# EAGLE design OpAmpAmplifier (EAGLE 6.5.0)
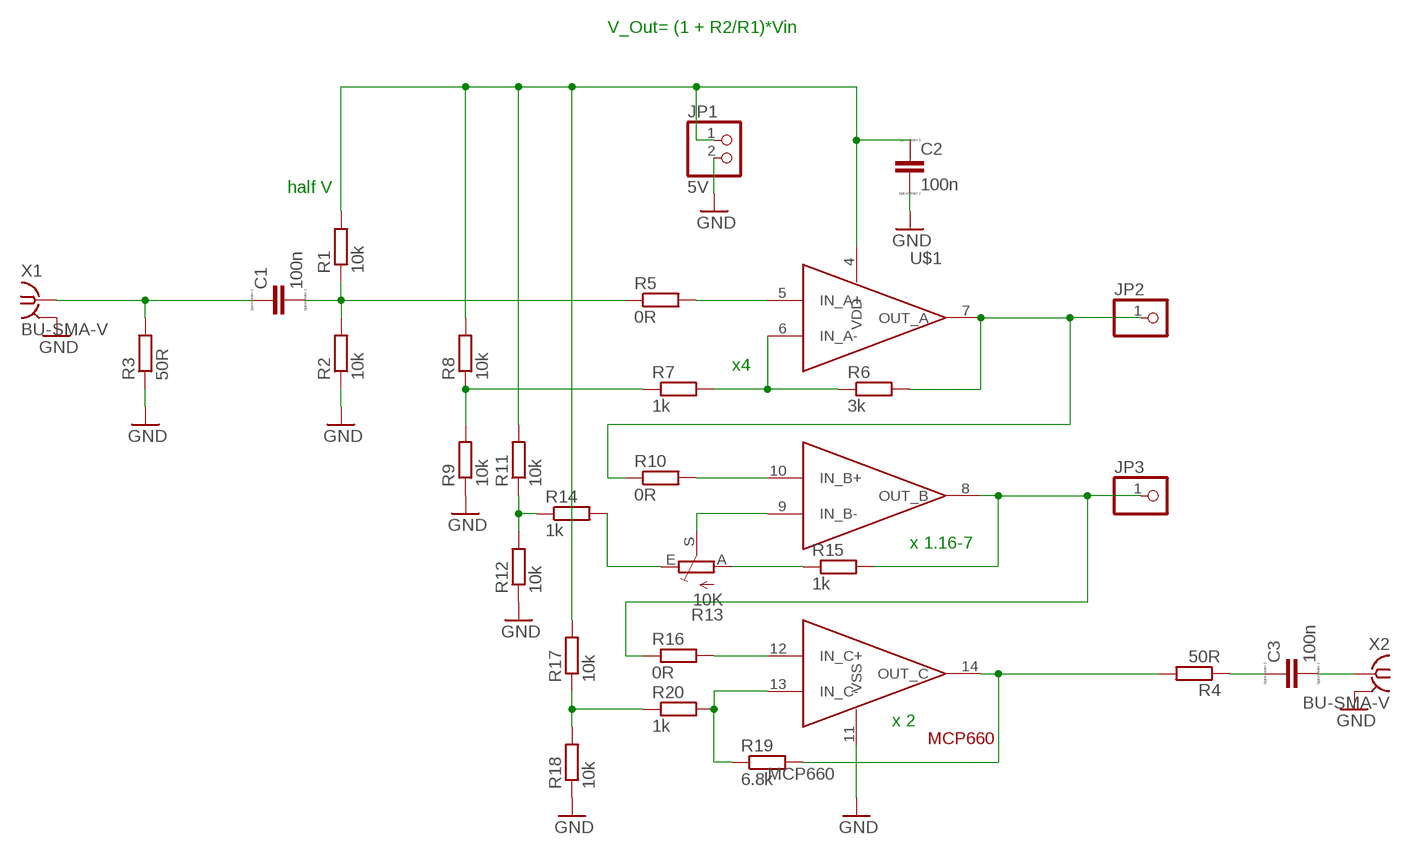
[diagram p0: schematic, sheet 1]

## Parts
C1  100n  C_SMD  [C0805]
C2  100n  C_SMD  [C0805]
C3  100n  C_SMD  [C0805]
JP1  5V  PINHD-1X2  [1X02]
JP2  PINHD-1X1  [1X01]
JP3  PINHD-1X1  [1X01]
R1  10k  R-EU_R0805  [R0805]
R2  10k  R-EU_R0805  [R0805]
R3  50R  R-EU_R0805  [R0805]
R4  50R  R-EU_R0805  [R0805]
R5  0R  R-EU_R0805  [R0805]
R6  3k  R-EU_R0805  [R0805]
R7  1k  R-EU_R0805  [R0805]
R8  10k  R-EU_R0805  [R0805]
R9  10k  R-EU_R0805  [R0805]
R10  0R  R-EU_R0805  [R0805]
R11  10k  R-EU_R0805  [R0805]
R12  10k  R-EU_R0805  [R0805]
R13  10K  TRIM_EU-CA6V  [CA6V]
R14  1k  R-EU_R0805  [R0805]
R15  1k  R-EU_R0805  [R0805]
R16  0R  R-EU_R0805  [R0805]
R17  10k  R-EU_R0805  [R0805]
R18  10k  R-EU_R0805  [R0805]
R19  6.8k  R-EU_R0805  [R0805]
R20  1k  R-EU_R0805  [R0805]
U$1  MCP660  [SO14]
X1  BU-SMA-V  [BU-SMA-V]
X2  BU-SMA-V  [BU-SMA-V]

## Nets
GND: C2.2 JP1.2 R2.1 R3.1 R9.1 R12.1 R18.1 U$1.11(VSS) X1.2 X1.3 X1.4 X1.5 X2.2 X2.3 X2.4 X2.5
N$1: C2.1 JP1.1 R1.2 R8.2 R11.2 R17.2 U$1.4(VDD)
N$2: C1.1 R3.2 X1.1
N$3: C1.2 R1.1 R2.2 R5.1
N$4: R10.2 U$1.10(IN_B+)
N$5: C3.1 R4.1
N$6: C3.2 X2.1
N$7: R5.2 U$1.5(IN_A+)
N$8: JP2.1 R6.2 R10.1 U$1.7(OUT_A)
N$9: R6.1 R7.2 U$1.6(IN_A-)
N$10: R7.1 R8.1 R9.2
N$11: R11.1 R12.2 R14.1
N$12: R13.E R14.2
N$13: JP3.1 R15.2 R16.1 U$1.8(OUT_B)
N$14: R13.S U$1.9(IN_B-)
N$15: R13.A R15.1
N$16: R16.2 U$1.12(IN_C+)
N$17: R17.1 R18.2 R20.1
N$18: R4.2 R19.2 U$1.14(OUT_C)
N$19: R19.1 R20.2 U$1.13(IN_C-)

## Notes on the sheet
- V_Out= (1 + R2/R1)*Vin
- half V
- x4
- x 1.16-7
- x 2

## Library data of the parts
C1-C3 = 0myLib:C_SMD: CAPACITOR, European symbol; SPICEMODEL: NONE; SPICEPREFIX: C
JP1 = 0myLib:PINHD-1X2: PIN HEADER
JP2 JP3 = 0myLib:PINHD-1X1: PIN HEADER
R1-R12 R14-R20 = 0myLib:R-EU_: RESISTOR, European symbol
R13 = pot:TRIM_EU-: POTENTIOMETER
U$1 = 0myLib:MCP660
X1 X2 = 0myLib:BU-SMA-V: FEMALE SMA CONNECTOR Radiall distributor RS 112-3794; OC_FARNELL: unknown; OC_NEWARK: unknown

## Board
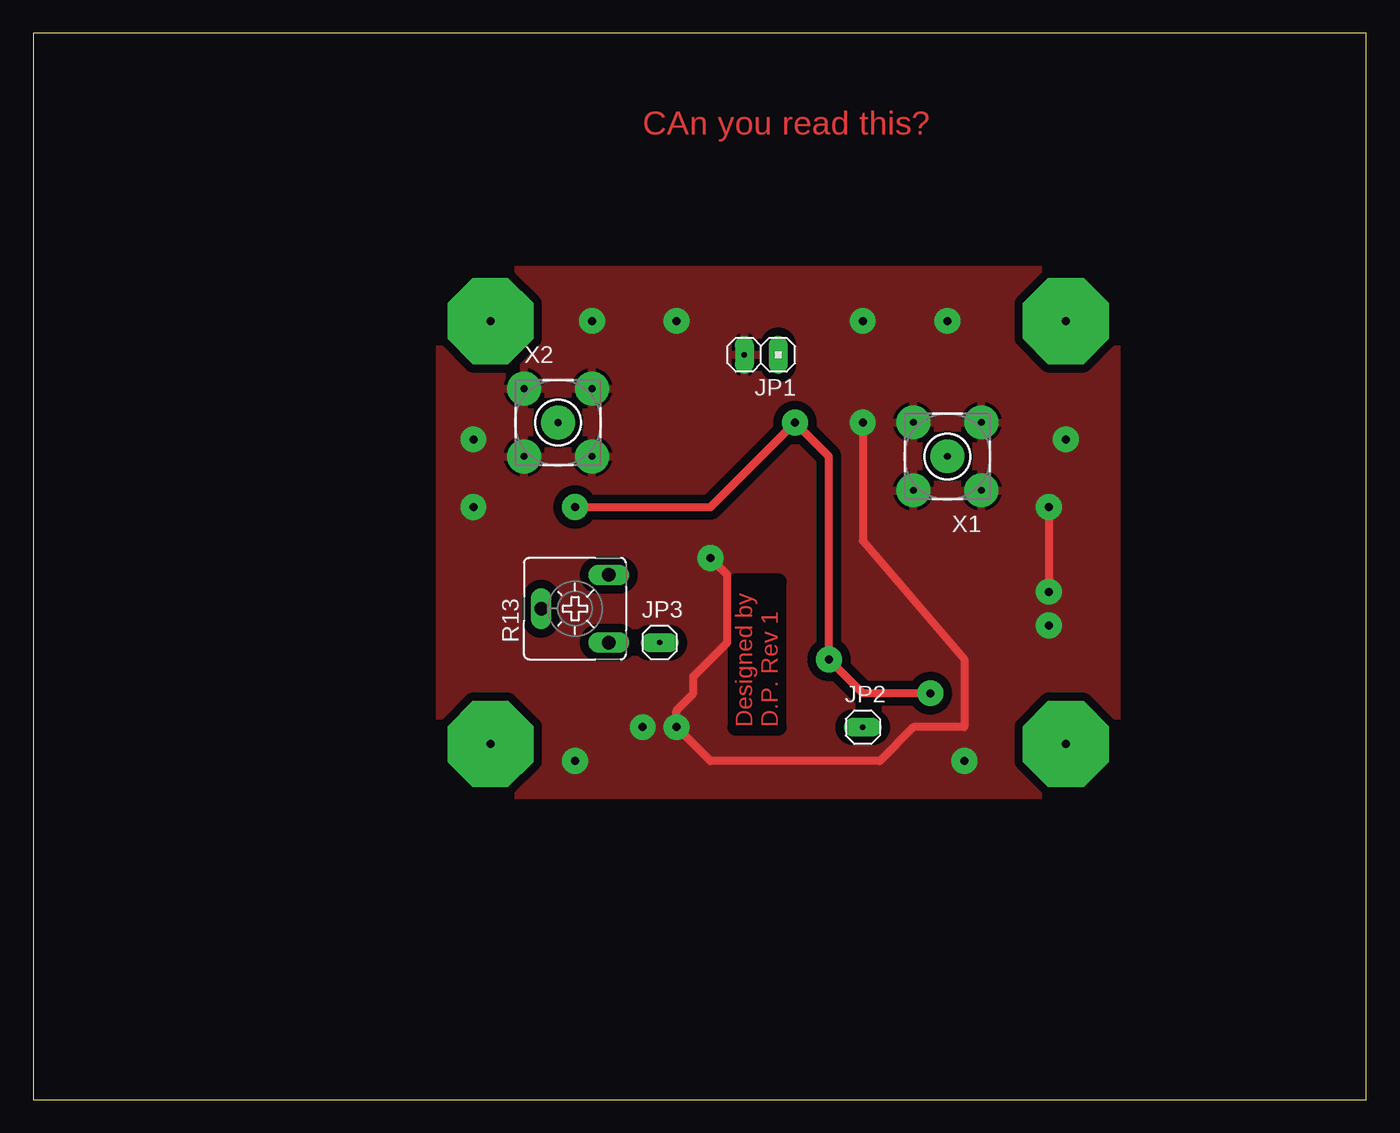
[diagram p1: board, top side]
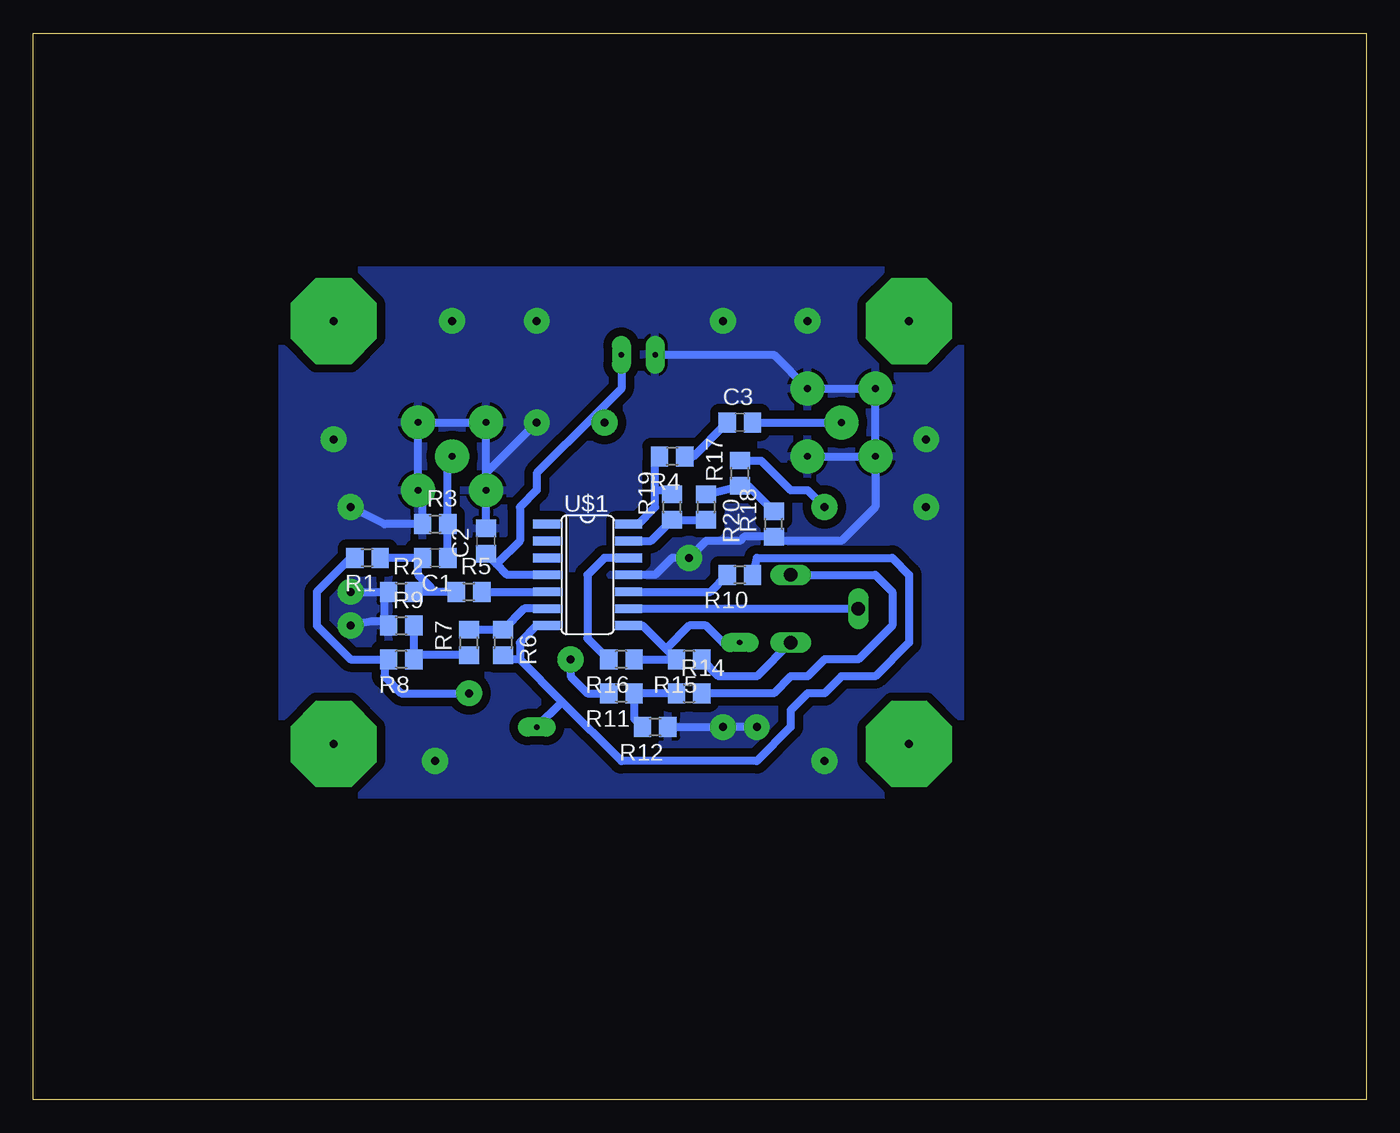
[diagram p2: board, bottom side, seen from below]

Size 100 x 80 mm. Coordinates in mm from the lower left corner, seen from the top.
Outline: 0,0 100,0 100,80 0,80 0,0
Copper layers (1*16): Top 0.035mm / dielectric 1.5mm / Bottom 0.035mm
Design rules "FinalizeAreaFill": minimum track width 12mil, minimum drill 1.4mm, track to track 25mil, track to pad 25mil, pad to pad 8mil, via to via 8mil, smd to smd 8mil, copper to edge 40mil, drill to drill 8mil, minimum pad ring 10mil, minimum via ring 8mil, stop-mask expansion 4mil, vias tented up to drill 0mil, thermal gap 10mil

### Footprints (pad centres in the part's own frame; a part is rotated, then mirrored left to right if it is on the bottom)
C0805 = smd 1.3 x 1.5: 1 -0.95,0; 2 0.95,0
1X02 = drill 0.4 pad 1.422 long: 1 -1.27,0; 2 1.27,0
1X01 = drill 0.4 pad 1.422 long: 1 0,0
R0805 = smd 1.3 x 1.5: 1 -0.95,0; 2 0.95,0
CA6V = drill 1.016 long: A -2.54,-2.54; E 2.54,-2.54; S 0,2.54
SO14 = smd 0.66 x 2.032: 1 -3.81,-3.073; 2 -2.54,-3.073; 3 -1.27,-3.073; 4 0,-3.073; 5 1.27,-3.073; 6 2.54,-3.073; 7 3.81,-3.073; 8 3.81,3.073; 9 2.54,3.073; 10 1.27,3.073; 11 0,3.073; 12 -1.27,3.073; 13 -2.54,3.073; 14 -3.81,3.073
BU-SMA-V = drill 0.5 pad 2.54: 1 0,0; 2 -2.55,2.55; 3 2.55,2.55; 4 2.55,-2.55; 5 -2.55,-2.55

### Placement (x,y rotation side)
C1  69.85,40.64 180 bottom
C2  66.04,41.91 90 bottom
C3  46.99,50.8 0 bottom
JP1  54.61,55.88 180 top
JP2  62.23,27.94 0 top
JP3  46.99,34.29 0 top
R1  74.93,40.64 180 bottom
R2  72.39,38.1 0 bottom
R3  69.85,43.18 0 bottom
R4  52.07,48.26 180 bottom
R5  67.31,38.1 0 bottom
R6  64.77,34.29 270 bottom
R7  67.31,34.29 90 bottom
R8  72.39,33.02 180 bottom
R9  72.39,35.56 0 bottom
R10  46.99,39.37 180 bottom
R11  55.88,30.48 180 bottom
R12  53.34,27.94 180 bottom
R13  40.64,36.83 90 top
R14  50.8,30.48 0 bottom
R15  50.8,33.02 180 bottom
R16  55.88,33.02 180 bottom
R17  46.99,46.99 90 bottom
R18  44.45,43.18 90 bottom
R19  52.07,44.45 90 bottom
R20  49.53,44.45 270 bottom
U$1  58.42,39.37 270 bottom
X1  68.58,48.26 180 top
X2  39.37,50.8 0 top

### Tracks (layer width: path | path; a pad name or v marks a point on that pad's centre or on a via)
GND  (via drill 0.6 pad 1.93)
  Top 0.61: v50.8,40.64 52.07,39.37 52.07,34.29 49.53,31.75 49.53,30.48 48.26,29.21 v48.26,27.94 50.8,25.4 63.5,25.4 66.04,27.94 69.85,27.94 69.85,33.02 62.23,41.91 v62.23,50.8 | v76.2,44.45 v76.2,38.1
  Bottom 0.61: R12.1 v48.26,27.94 v45.72,27.94 | U$1.11 53.34,39.37 52.07,40.64 v50.8,40.64 49.53,41.91 46.99,41.91 46.67,42.23 R18.1 44.13,41.91 39.37,41.91 36.82,44.46 X2.5 | 73.66,35.88 R9.1 | C2.2 X1.3 | JP1.2 44.45,55.88 X2.3 X2.2 X2.5 | 73.66,35.88 74.61,35.88 v76.2,35.56 | v76.2,44.45 73.66,43.18 R3.1 70.8,45.38 X1.2 X1.5 X1.4 C2.2 | X2.4 X2.5 | C2.2 66.04,46.99 v62.23,50.8 | 73.66,35.88 73.66,37.78 R2.1 v76.2,38.1
  other vias: 41.91,58.42 48.26,58.42 62.23,58.42 68.58,58.42 77.47,49.53 69.85,25.4 40.64,25.4 33.02,44.45 33.02,49.53
  pour Bottom: 30.48,62.23 30.48,22.86 81.28,22.86 81.28,62.23
  pour Top: 30.48,62.23 30.48,22.86 81.28,22.86 81.28,62.23
N$1  (via drill 0.6 pad 1.93)
  Top 0.61: v67.31,30.48 62.23,30.48 v59.69,33.02 59.69,48.26 v57.15,50.8 50.8,44.45 v40.64,44.45
  Bottom 0.61: U$1.4 64.45,39.37 65.25,40.16 | 65.25,40.16 C2.1 | v67.31,30.48 72.39,30.48 73.66,31.75 73.66,33.02 R8.2 76.2,33.02 78.74,35.56 78.74,38.1 76.2,40.64 R1.2 | v59.69,33.02 59.69,31.75 58.42,30.48 R11.2 | 57.78,51.44 55.88,53.34 JP1.1 | 57.78,51.44 62.23,46.99 62.23,45.72 63.5,44.45 63.5,41.91 65.25,40.16 | R17.2 45.4,47.94 43.18,45.72 41.91,45.72 v40.64,44.45 | v57.15,50.8 57.78,51.44
N$2
  Bottom 0.61: C1.1 R3.2 68.9,47.94 X1.1
N$3
  Bottom 0.61: R5.1 R2.2 70.17,38.42 71.12,39.37 71.12,40.32 C1.2 R1.1
N$4
  Bottom 0.61: U$1.10 49.21,38.1 R10.2
N$5
  Bottom 0.61: R4.1 50.48,48.26 C3.1
N$6
  Bottom 0.61: C3.2 X2.1
N$7
  Bottom 0.61: R5.2 U$1.5
N$8
  Bottom 0.61: R10.1 46.04,39.05 45.72,40.64 35.56,40.64 34.29,39.37 34.29,34.29 36.83,31.75 39.37,31.75 40.64,30.48 41.91,30.48 43.18,29.21 43.18,27.94 45.72,25.4 55.88,25.4 60.33,29.84 | U$1.7 62.23,35.56 63.5,34.29 63.5,33.02 | 63.5,33.02 64.45,33.02 R6.2 | 60.33,29.84 63.5,33.02 | JP2.1 60.33,29.84
N$9
  Bottom 0.61: U$1.6 63.18,36.83 R6.1 R7.2
N$10
  Bottom 0.61: R9.2 R8.1 71.12,33.34 R7.1
N$11
  Bottom 0.61: R14.1 R11.1 54.93,28.58 R12.2
N$12
  Bottom 0.61: R13.E 36.83,39.37 35.56,38.1 35.56,35.56 38.1,33.02 40.64,33.02 41.91,31.75 43.18,31.75 44.45,30.48 R14.2
N$13
  Bottom 0.61: U$1.8 54.29,35.56 52.55,33.81 | 52.55,33.81 R15.2 R16.1 | JP3.1 48.26,34.29 49.53,35.56 50.8,35.56 52.55,33.81
N$14
  Bottom 0.61: U$1.9 R13.S
N$15
  Bottom 0.61: R13.A 45.72,31.75 48.58,31.75 R15.1
N$16
  Bottom 0.61: U$1.12 57.15,40.64 58.42,39.37 58.42,34.61 R16.2
N$17
  Bottom 0.61: R20.1 R17.1 46.36,46.04 R18.2
N$18
  Bottom 0.61: U$1.14 54.61,43.18 53.34,44.45 53.34,45.72 | 53.34,45.72 52.39,45.72 R19.2 | 53.34,45.72 53.34,47.94 R4.2
N$19
  Bottom 0.61: U$1.13 53.66,41.91 R19.1 R20.2
N$20  (via drill 0.6 pad 6.45)
  other vias: 34.29,26.67
N$21  (via drill 0.6 pad 6.45)
  other vias: 77.47,26.67
N$22  (via drill 0.6 pad 6.45)
  other vias: 34.29,58.42
N$23  (via drill 0.6 pad 6.45)
  other vias: 77.47,58.42

### Text on the board
Top: CAn you read this? | Designed by / D.P. Rev 1